# Altium project PCB_TFM.PrjPcb
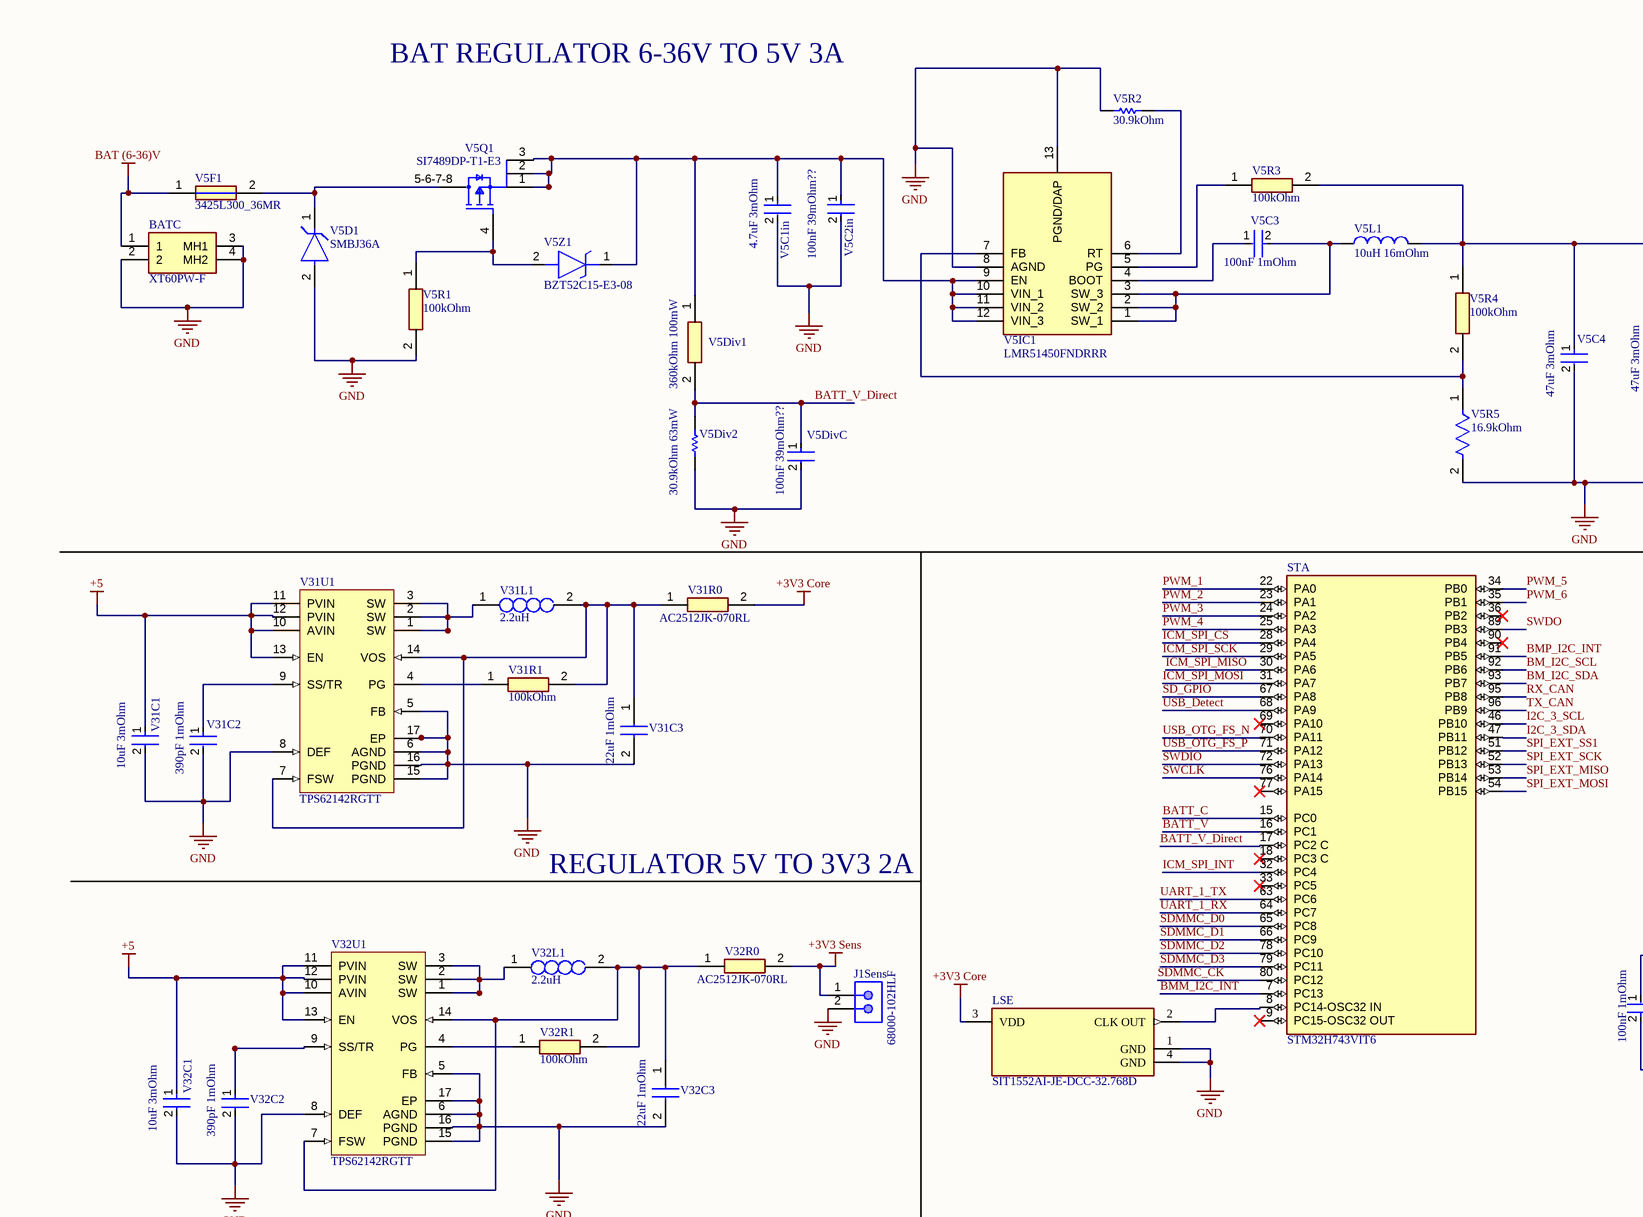
[diagram p0: Schematic_TFM.SchDoc, top left]
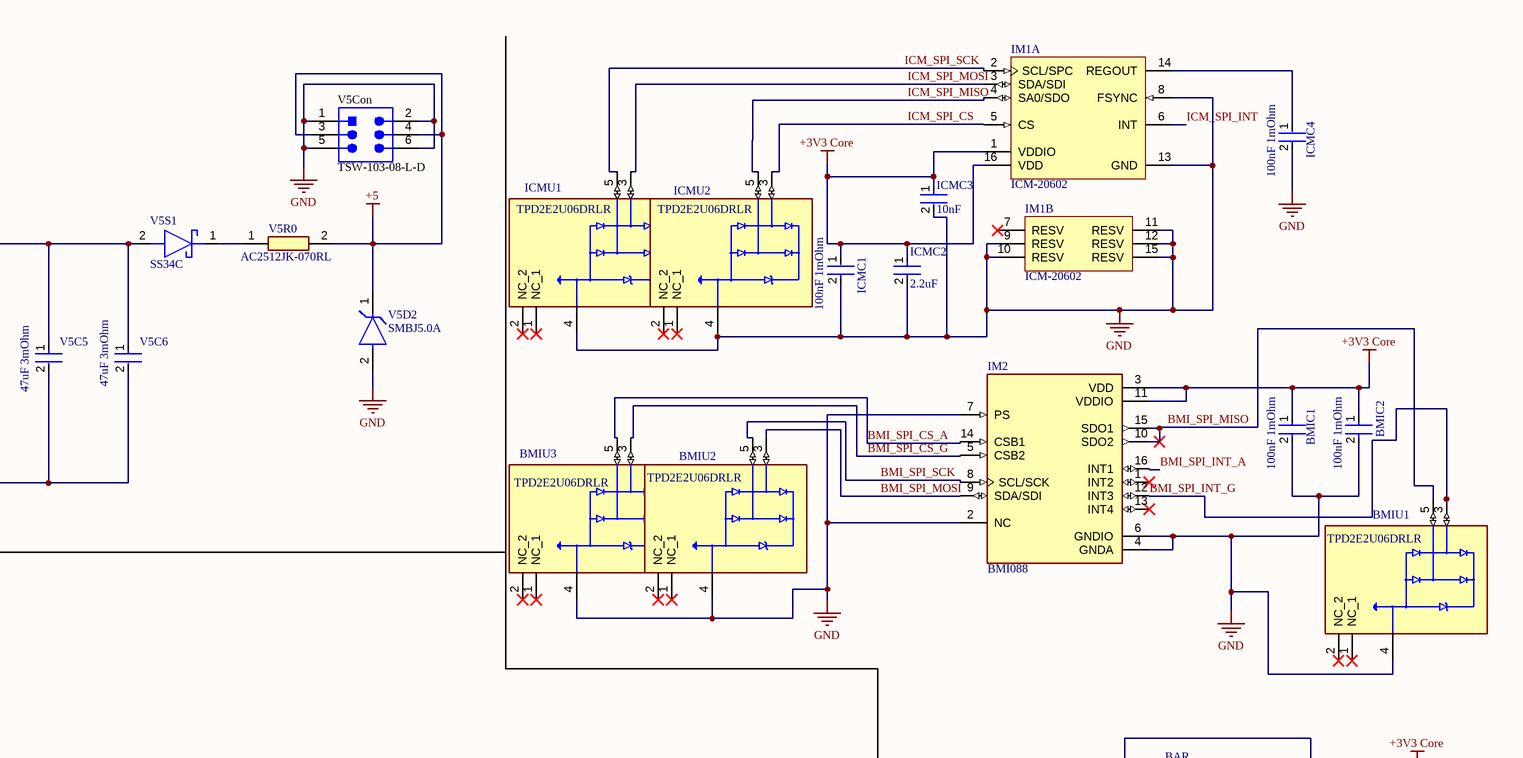
[diagram p1: Schematic_TFM.SchDoc, top right]
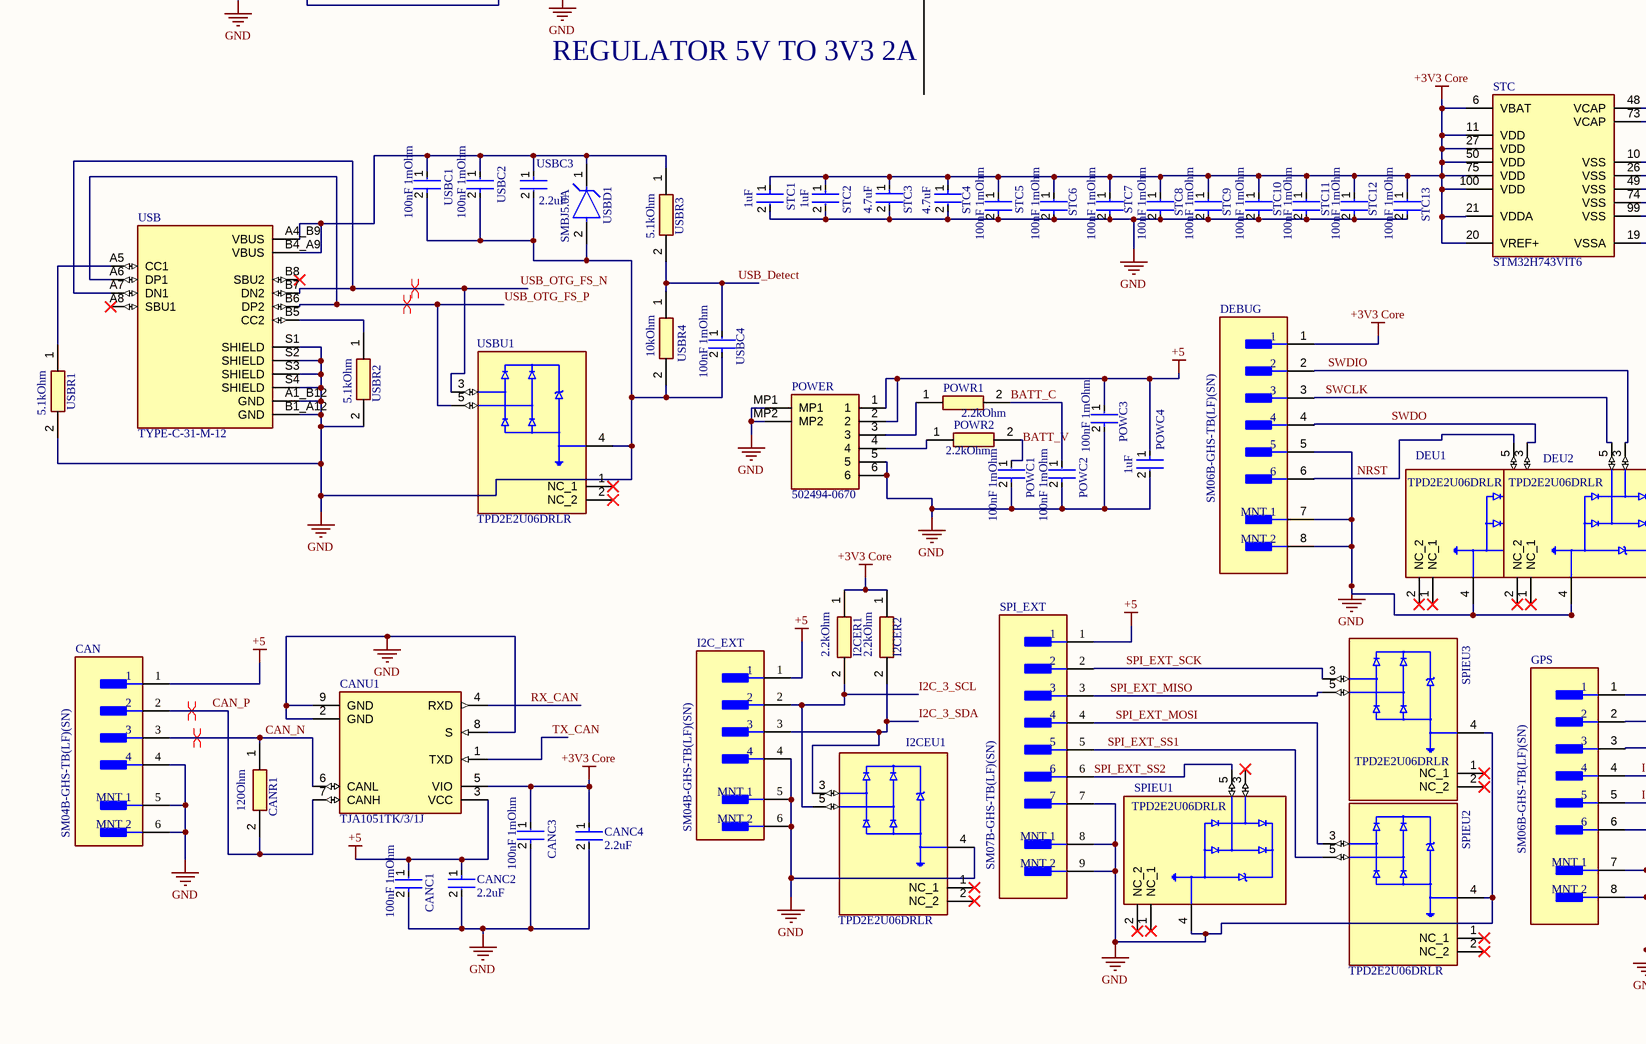
[diagram p2: Schematic_TFM.SchDoc, bottom left]
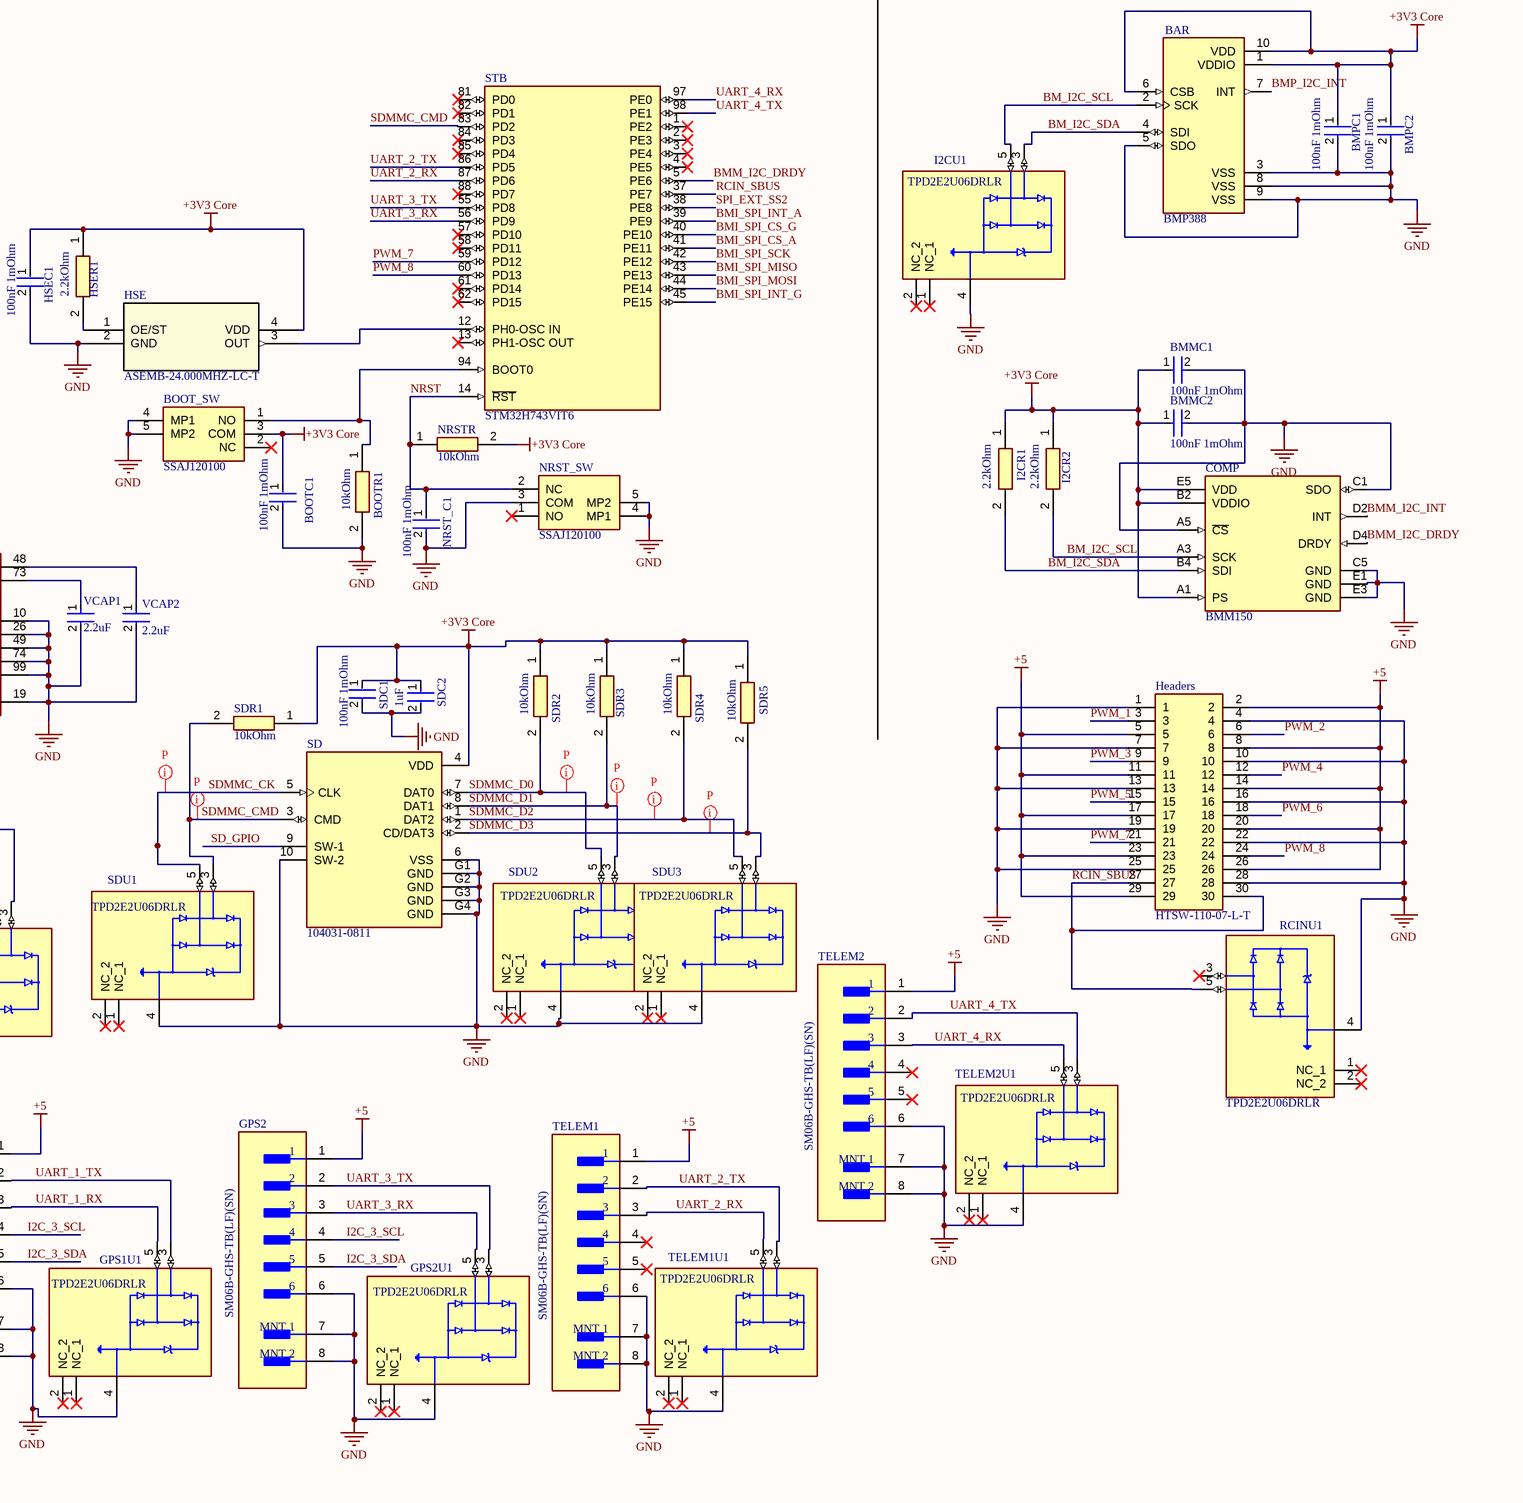
[diagram p3: Schematic_TFM.SchDoc, bottom right]
1 sheet, 145 parts. Net scope: global (net labels, ports and power ports of the same name join across sheets).
Board file: PCB_mounting.PcbDoc

## Sheet Schematic_TFM.SchDoc: DRONE PCB
size 594 x 420 mm; Date: 2025; Author: Alejnadro Boadella; CompanyName: UPC EETAC; Organization: UPC EETAC; SheetNumber: 1; SheetTotal: 1; Time: 2025

### Parts
BAR  BMP388  [PQFN50P200X200X80-10N]
BATC  XT60PW-F  [XT60PWF]
BMIC1  100nF 1mOhm  [FP-GRM15-MFG]
BMIC2  100nF 1mOhm  [FP-GRM15-MFG]
BMIU1  TPD2E2U06DRLR  [SOTFL50P160X60-5N]
BMIU2  TPD2E2U06DRLR  [SOTFL50P160X60-5N]
BMIU3  TPD2E2U06DRLR  [SOTFL50P160X60-5N]
BMMC1  100nF 1mOhm  [FP-GRM15-MFG]
BMMC2  100nF 1mOhm  [FP-GRM15-MFG]
BMPC1  100nF 1mOhm  [FP-GRM15-MFG]
BMPC2  100nF 1mOhm  [FP-GRM15-MFG]
BOOT_SW  SSAJ120100  [SSAJ120100]
BOOTC1  100nF 1mOhm  [FP-GRM15-MFG]
BOOTR1  10kOhm  [RESC1608X55N]
CAN  SM04B-GHS-TB(LF)(SN)  [FP-SM04B-GHS-TB_LF_SN-MFG]
CANC1  100nF 1mOhm  [FP-GRM15-MFG]
CANC2  2.2uF  [FP-CL50-IPC_C]
CANC3  100nF 1mOhm  [FP-GRM15-MFG]
CANC4  2.2uF  [FP-CL50-IPC_C]
CANR1  120Ohm  [RESC1608X55N]
CANU1  TJA1051TK/3/1J  [FP-SOT782-1-MFG]
COMP  BMM150  [FP-BMM150-MFG]
DEBUG  SM06B-GHS-TB(LF)(SN)  [FP-SM06B-GHS-TB_LF_SN-MFG]
DEU1  TPD2E2U06DRLR  [SOTFL50P160X60-5N]
DEU2  TPD2E2U06DRLR  [SOTFL50P160X60-5N]
GPS  SM06B-GHS-TB(LF)(SN)  [FP-SM06B-GHS-TB_LF_SN-MFG]
GPS1U1  TPD2E2U06DRLR  [SOTFL50P160X60-5N]
GPS2  SM06B-GHS-TB(LF)(SN)  [FP-SM06B-GHS-TB_LF_SN-MFG]
GPS2U1  TPD2E2U06DRLR  [SOTFL50P160X60-5N]
Headers  HTSW-110-07-L-T  [HDRV30W64P254_3X10_2540X756X838P]
HSE  ASEMB-24.000MHZ-LC-T  [SON4_SIT1602-2_SIT]
HSEC1  100nF 1mOhm  [FP-GRM15-MFG]
HSER1  2.2kOhm  [RESC1608X55N]
I2C_EXT  SM04B-GHS-TB(LF)(SN)  [FP-SM04B-GHS-TB_LF_SN-MFG]
I2CER1  2.2kOhm  [RESC1608X55N]
I2CER2  2.2kOhm  [RESC1608X55N]
I2CEU1  TPD2E2U06DRLR  [SOTFL50P160X60-5N]
I2CR1  2.2kOhm  [RESC1608X55N]
I2CR2  2.2kOhm  [RESC1608X55N]
I2CU1  TPD2E2U06DRLR  [SOTFL50P160X60-5N]
ICMC1  100nF 1mOhm  [FP-GRM15-MFG]
ICMC2  2.2uF  [FP-CL50-IPC_C]
ICMC3  10nF  [FP-CL165-IPC_C]
ICMC4  100nF 1mOhm  [FP-GRM15-MFG]
ICMU1  TPD2E2U06DRLR  [SOTFL50P160X60-5N]
ICMU2  TPD2E2U06DRLR  [SOTFL50P160X60-5N]
IM1  ICM-20602  [INSE-I62-16]  (parts A,B of 2)
IM2  BMI088  [PQFN50P450X300X100-16N]
J1Sens  68000-102HLF  [AMPH-68000-102HLF_V]
LSE  SIT1552AI-JE-DCC-32.768D  [FP-SiT1552-J-MFG]
NRST_C1  100nF 1mOhm  [FP-GRM15-MFG]
NRST_SW  SSAJ120100  [SSAJ120100]
NRSTR  10kOhm  [RESC1608X55N]
POWC1  100nF 1mOhm  [FP-GRM15-MFG]
POWC2  100nF 1mOhm  [FP-GRM15-MFG]
POWC3  100nF 1mOhm  [FP-GRM15-MFG]
POWC4  1uF  [FP-CL542-IPC_C]
POWER  502494-0670  [5024940670]
POWR1  2.2kOhm  [RESC1608X55N]
POWR2  2.2kOhm  [RESC1608X55N]
RCINU1  TPD2E2U06DRLR  [SOTFL50P160X60-5N]
SD  104031-0811  [MOLEX_104031-0811]
SDC1  100nF 1mOhm  [FP-GRM15-MFG]
SDC2  1uF  [FP-CL542-IPC_C]
SDR1  10kOhm  [RESC1608X55N]
SDR2  10kOhm  [RESC1608X55N]
SDR3  10kOhm  [RESC1608X55N]
SDR4  10kOhm  [RESC1608X55N]
SDR5  10kOhm  [RESC1608X55N]
SDU1  TPD2E2U06DRLR  [SOTFL50P160X60-5N]
SDU2  TPD2E2U06DRLR  [SOTFL50P160X60-5N]
SDU3  TPD2E2U06DRLR  [SOTFL50P160X60-5N]
SPI_EXT  SM07B-GHS-TB(LF)(SN)  [FP-SM07B-GHS-TB_LF_SN-MFG]
SPIEU1  TPD2E2U06DRLR  [SOTFL50P160X60-5N]
SPIEU2  TPD2E2U06DRLR  [SOTFL50P160X60-5N]
SPIEU3  TPD2E2U06DRLR  [SOTFL50P160X60-5N]
ST  STM32H743VIT6  [FP-LQFP100-1L-MFG]  (parts A,B,C of 3)
STC1  1uF  [FP-CL542-IPC_C]
STC2  1uF  [FP-CL542-IPC_C]
STC3  4.7uF  [FP-CL282-IPC_C]
STC4  4.7uF  [FP-CL282-IPC_C]
STC5  100nF 1mOhm  [FP-GRM15-MFG]
STC6  100nF 1mOhm  [FP-GRM15-MFG]
STC7  100nF 1mOhm  [FP-GRM15-MFG]
STC8  100nF 1mOhm  [FP-GRM15-MFG]
STC9  100nF 1mOhm  [FP-GRM15-MFG]
STC10  100nF 1mOhm  [FP-GRM15-MFG]
STC11  100nF 1mOhm  [FP-GRM15-MFG]
STC12  100nF 1mOhm  [FP-GRM15-MFG]
STC13  100nF 1mOhm  [FP-GRM15-MFG]
TELEM1  SM06B-GHS-TB(LF)(SN)  [FP-SM06B-GHS-TB_LF_SN-MFG]
TELEM1U1  TPD2E2U06DRLR  [SOTFL50P160X60-5N]
TELEM2  SM06B-GHS-TB(LF)(SN)  [FP-SM06B-GHS-TB_LF_SN-MFG]
TELEM2U1  TPD2E2U06DRLR  [SOTFL50P160X60-5N]
USB  TYPE-C-31-M-12  [HRO_TYPE-C-31-M-12]
USBC1  100nF 1mOhm  [FP-GRM15-MFG]
USBC2  100nF 1mOhm  [FP-GRM15-MFG]
USBC3  2.2uF  [FP-CL50-IPC_C]
USBC4  100nF 1mOhm  [FP-GRM15-MFG]
USBD1  SMBJ5.0A  [FP-SMBJ-MFG]
USBR1  5.1kOhm  [RESC1608X55N]
USBR2  5.1kOhm  [RESC1608X55N]
USBR3  5.1kOhm  [RESC1608X55N]
USBR4  10kOhm  [RESC1608X55N]
USBU1  TPD2E2U06DRLR  [SOTFL50P160X60-5N]
V5C1in  4.7uF 3mOhm  [FP-GRM31C-0_2-e0_3_0_8-IPC_C]
V5C2in  100nF 39mOhm??  [FP-GRM155-0_05-IPC_B]
V5C3  100nF 1mOhm  [FP-GRM15-MFG]
V5C4  47uF 3mOhm  [FP-GRM32E-0_3-0_2-IPC_C]
V5C5  47uF 3mOhm  [FP-GRM32E-0_3-0_2-IPC_C]
V5C6  47uF 3mOhm  [FP-GRM32E-0_3-0_2-IPC_C]
V5Con  TSW-103-08-L-D  [SMTC-TSW-103-08-L-D_V]
V5D1  SMBJ36A  [FP-SMBJ-MFG]
V5D2  SMBJ5.0A  [FP-SMBJ-MFG]
V5Div1  360kOhm 100mW  [RESC1608X55N]
V5Div2  30.9kOhm 63mW  [RESC1005X40X25LL05T05]
V5DivC  100nF 39mOhm??  [FP-GRM155-0_05-IPC_B]
V5F1  3425L300_36MR  [FUSC8664X140N]
V5IC1  LMR51450FNDRRR  [SON50P300X300X80-13N-D]
V5L1  10uH 16mOhm  [SUMI-CDRH127_V]
V5Q1  SI7489DP-T1-E3  [FP-S17-0173-SINGLE-MFG]
V5R0  AC2512JK-070RL  [RESC6431X65N]
V5R1  100kOhm  [RESC2013X65N]
V5R2  30.9kOhm  [RESC1005X40X25LL05T05]
V5R3  100kOhm  [RESC2013X65N]
V5R4  100kOhm  [RESC2013X65N]
V5R5  16.9kOhm  [FP-CRCW0402-e3-MFG]
V5S1  SS34C  [DIOM7959X262N]
V5Z1  BZT52C15-E3-08  [SOD3716X135N]
V31C1  10uF 3mOhm  [FP-C0805C-DG-MFG]
V31C2  390pF 1mOhm  [FP-CC0603-DA-MFG]
V31C3  22uF 1mOhm  [CAPC1608X90N]
V31L1  2.2uH  [INDPM4042X200N]
V31R0  AC2512JK-070RL  [RESC6431X65N]
V31R1  100kOhm  [RESC2013X65N]
V31U1  TPS62142RGTT  [RGT0016C_V]
V32C1  10uF 3mOhm  [FP-C0805C-DG-MFG]
V32C2  390pF 1mOhm  [FP-CC0603-DA-MFG]
V32C3  22uF 1mOhm  [CAPC1608X90N]
V32L1  2.2uH  [INDPM4042X200N]
V32R0  AC2512JK-070RL  [RESC6431X65N]
V32R1  100kOhm  [RESC2013X65N]
V32U1  TPS62142RGTT  [RGT0016C_V]
VCAP1  2.2uF  [FP-CL50-IPC_C]
VCAP2  2.2uF  [FP-CL50-IPC_C]

### Nets
+3V3 Core: BAR.1(VDDIO) BAR.6(CSB) BAR.10(VDD) BMIC1.1 BMIC2.1 BMMC1.1 BMMC2.1 BMPC1.1 BMPC2.1 BOOT_SW.3(COM) BOOTC1.1 CANC3.1 CANC4.1 CANU1.5(VIO) COMP.A1(PS) COMP.B2(VDDIO) COMP.E5(VDD) DEBUG.1 HSE.4(VDD) HSEC1.1 HSER1.1 I2CER1.1 I2CER2.1 I2CR1.1 I2CR2.1 ICMC1.1 ICMC2.1 ICMC3.1 IM1.1(VDDIO) IM1.16(VDD) IM2.3(VDD) IM2.11(VDDIO) LSE.3(VDD) NRSTR.2 SD.4(VDD) SDC1.1 SDC2.1 SDR1.1 SDR2.1 SDR3.1 SDR4.1 SDR5.1 ST.6(VBAT) ST.11(VDD) ST.20(VREF+) ST.21(VDDA) ST.27(VDD) ST.50(VDD) ST.75(VDD) ST.100(VDD) STC1.1 STC2.1 STC3.1 STC4.1 STC5.1 STC6.1 STC7.1 STC8.1 STC9.1 STC10.1 STC11.1 STC12.1 STC13.1 V31R0.2
+3V3 Sens: J1Sens.1 V32R0.2
+5: CAN.1 CANC1.1 CANC2.1 CANU1.3(VCC) GPS.1 GPS2.1 Headers.2 Headers.5 Headers.8 Headers.11 Headers.14 Headers.17 Headers.20 Headers.23 Headers.26 Headers.29 I2C_EXT.1 POWC3.1 POWC4.1 POWER.1 POWER.2 SPI_EXT.1 TELEM1.1 TELEM2.1 V5Con.3 V5Con.4 V5D2.1(C) V5R0.2 V31C1.1 V31U1.10(AVIN) V31U1.11(PVIN) V31U1.12(PVIN) V31U1.13(EN) V32C1.1 V32U1.10(AVIN) V32U1.11(PVIN) V32U1.12(PVIN) V32U1.13(EN)
BAT (6-36)V: BATC.1 V5F1.1
GND: BAR.3(VSS) BAR.5(SDO) BAR.8(VSS) BAR.9(VSS) BATC.2 BATC.3(MH1) BATC.4(MH2) BMIC1.2 BMIC2.2 BMIU1.4(GND) BMIU2.4(GND) BMIU3.4(GND) BMMC1.2 BMMC2.2 BMPC1.2 BMPC2.2 BOOT_SW.4(MP1) BOOT_SW.5(MP2) BOOTC1.2 BOOTR1.2 CAN.4 CAN.5(MNT_1) CAN.6(MNT_2) CANC1.2 CANC2.2 CANC3.2 CANC4.2 CANU1.2(GND) CANU1.8(S) CANU1.9(GND) COMP.A5(~{CS}) COMP.C1(SDO) COMP.C5(GND) COMP.E1(GND) COMP.E3(GND) DEBUG.5 DEBUG.7(MNT_1) DEBUG.8(MNT_2) DEU1.4(GND) DEU2.4(GND) GPS.6 GPS.7(MNT_1) GPS.8(MNT_2) GPS1U1.4(GND) GPS2.6 GPS2.7(MNT_1) GPS2.8(MNT_2) GPS2U1.4(GND) Headers.1 Headers.4 Headers.7 Headers.10 Headers.13 Headers.16 Headers.19 Headers.22 Headers.25 Headers.28 HSE.2(GND) HSEC1.2 I2C_EXT.4 I2C_EXT.5(MNT_1) I2C_EXT.6(MNT_2) I2CEU1.4(GND) I2CU1.4(GND) ICMC1.2 ICMC2.2 ICMC3.2 ICMC4.2 ICMU1.4(GND) ICMU2.4(GND) IM1.8(FSYNC) IM1.9(RESV) IM1.10(RESV) IM1.11(RESV) IM1.12(RESV) IM1.13(GND) IM1.15(RESV) IM2.2(NC) IM2.4(GNDA) IM2.6(GNDIO) IM2.7(PS) J1Sens.2 LSE.1(GND) LSE.4(GND) NRST_C1.2 NRST_SW.3(COM) NRST_SW.4(MP1) NRST_SW.5(MP2) POWC1.2 POWC2.2 POWC3.2 POWC4.2 POWER.5 POWER.6 POWER.MP1 POWER.MP2 RCINU1.4(GND) SD.6(VSS) SD.10(SW-2) SD.G1(GND) SD.G2(GND) SD.G3(GND) SD.G4(GND) SDC1.2 SDC2.2 SDU1.4(GND) SDU2.4(GND) SDU3.4(GND) SPI_EXT.7 SPI_EXT.8(MNT_1) SPI_EXT.9(MNT_2) SPIEU1.4(GND) SPIEU2.4(GND) SPIEU3.4(GND) ST.10(VSS) ST.19(VSSA) ST.26(VSS) ST.49(VSS) ST.74(VSS) ST.99(VSS) STC1.2 STC2.2 STC3.2 STC4.2 STC5.2 STC6.2 STC7.2 STC8.2 STC9.2 STC10.2 STC11.2 STC12.2 STC13.2 TELEM1.6 TELEM1.7(MNT_1) TELEM1.8(MNT_2) TELEM1U1.4(GND) TELEM2.6 TELEM2.7(MNT_1) TELEM2.8(MNT_2) TELEM2U1.4(GND) USB.A1_B12(GND) USB.B1_A12(GND) USB.S1(SHIELD) USB.S2(SHIELD) USB.S3(SHIELD) USB.S4(SHIELD) USBC1.2 USBC2.2 USBC3.2 USBC4.2 USBD1.2(A) USBR1.2 USBR2.2 USBR4.2 USBU1.4(GND) V5C1in.2 V5C2in.2 V5C4.2 V5C5.2 V5C6.2 V5Con.1 V5Con.2 V5Con.5 V5Con.6 V5D1.2(A) V5D2.2(A) V5Div2.2 V5DivC.2 V5IC1.8(AGND) V5IC1.13(PGND/DAP) V5R1.2 V5R2.2 V5R5.2 V31C1.2 V31C2.2 V31C3.2 V31U1.5(FB) V31U1.6(AGND) V31U1.8(DEF) V31U1.15(PGND) V31U1.16(PGND) V31U1.17(EP) V32C1.2 V32C2.2 V32C3.2 V32U1.5(FB) V32U1.6(AGND) V32U1.8(DEF) V32U1.15(PGND) V32U1.16(PGND) V32U1.17(EP) VCAP1.2 VCAP2.2
BATT_C: POWC2.1 POWR1.2 ST.15(PC0)
BATT_V: POWC1.1 POWR2.2 ST.16(PC1)
BATT_V_Direct: ST.17(PC2_C) V5Div1.2 V5Div2.1 V5DivC.1
BM_I2C_SCL: BAR.2(SCK) COMP.A3(SCK) I2CR2.2 I2CU1.5(IO2) ST.92(PB6)
BM_I2C_SDA: BAR.4(SDI) COMP.B4(SDI) I2CR1.2 I2CU1.3(IO1) ST.93(PB7)
BMI_SPI_CS_A: BMIU3.5(IO2) IM2.14(CSB1) ST.41(PE11)
BMI_SPI_CS_G: BMIU3.3(IO1) IM2.5(CSB2) ST.40(PE10)
BMI_SPI_INT_A: IM2.16(INT1) ST.39(PE9)
BMI_SPI_INT_G: BMIU1.3(IO1) IM2.12(INT3) ST.45(PE15)
BMI_SPI_MISO: BMIU1.5(IO2) IM2.10(SDO2) IM2.15(SDO1) ST.43(PE13)
BMI_SPI_MOSI: BMIU2.3(IO1) IM2.9(SDA/SDI) ST.44(PE14)
BMI_SPI_SCK: BMIU2.5(IO2) IM2.8(SCL/SCK) ST.42(PE12)
BMM_I2C_DRDY: COMP.D4(DRDY) ST.5(PE6)
BMM_I2C_INT: COMP.D2(INT) ST.7(PC13)
BMP_I2C_INT: BAR.7(INT) ST.91(PB5)
CAN_N: CAN.3 CANR1.1 CANU1.6(CANL)
CAN_P: CAN.2 CANR1.2 CANU1.7(CANH)
I2C_3_SCL: GPS.4 GPS2.4 I2C_EXT.2 I2CER1.2 I2CEU1.5(IO2) ST.46(PB10)
I2C_3_SDA: GPS.5 GPS2.5 I2C_EXT.3 I2CER2.2 I2CEU1.3(IO1) ST.47(PB11)
ICM_SPI_CS: ICMU2.3(IO1) IM1.5(CS) ST.28(PA4)
ICM_SPI_INT: IM1.6(INT) ST.32(PC4)
ICM_SPI_MISO: ICMU2.5(IO2) IM1.4(SA0/SDO) ST.30(PA6)
ICM_SPI_MOSI: ICMU1.3(IO1) IM1.3(SDA/SDI) ST.31(PA7)
ICM_SPI_SCK: ICMU1.5(IO2) IM1.2(SCL/SPC) ST.29(PA5)
NRST: DEBUG.6 DEU1.5(IO2) NRST_C1.1 NRST_SW.2(NC) NRSTR.1 ST.14(~{RST})
PWM_1: Headers.3 ST.22(PA0)
PWM_2: Headers.6 ST.23(PA1)
PWM_3: Headers.9 ST.24(PA2)
PWM_4: Headers.12 ST.25(PA3)
PWM_5: Headers.15 ST.34(PB0)
PWM_6: Headers.18 ST.35(PB1)
PWM_7: Headers.21 ST.59(PD12)
PWM_8: Headers.24 ST.60(PD13)
RCIN_SBUS: Headers.27 Headers.30 RCINU1.5(IO2) ST.37(PE7)
RX_CAN: CANU1.4(RXD) ST.95(PB8)
SD_GPIO: SD.9(SW-1) ST.67(PA8)
SDMMC_CK: SD.5(CLK) SDU1.5(IO2) ST.80(PC12)
SDMMC_CMD: SD.3(CMD) SDR1.2 SDU1.3(IO1) ST.83(PD2)
SDMMC_D0: SD.7(DAT0) SDR2.2 SDU2.5(IO2) ST.65(PC8)
SDMMC_D1: SD.8(DAT1) SDR3.2 SDU2.3(IO1) ST.66(PC9)
SDMMC_D2: SD.1(DAT2) SDR4.2 SDU3.5(IO2) ST.78(PC10)
SDMMC_D3: SD.2(CD/DAT3) SDR5.2 SDU3.3(IO1) ST.79(PC11)
SPI_EXT_MISO: SPI_EXT.3 SPIEU3.5(IO2) ST.53(PB14)
SPI_EXT_MOSI: SPI_EXT.4 SPIEU2.3(IO1) ST.54(PB15)
SPI_EXT_SCK: SPI_EXT.2 SPIEU3.3(IO1) ST.52(PB13)
SPI_EXT_SS1: SPI_EXT.5 SPIEU2.5(IO2) ST.51(PB12)
SPI_EXT_SS2: SPI_EXT.6 SPIEU1.5(IO2) ST.38(PE8)
SWCLK: DEBUG.3 DEU2.5(IO2) ST.76(PA14)
SWDIO: DEBUG.2 DEU2.3(IO1) ST.72(PA13)
SWDO: DEBUG.4 DEU1.3(IO1) ST.89(PB3)
TX_CAN: CANU1.1(TXD) ST.96(PB9)
UART_1_RX: GPS.3 GPS1U1.5(IO2) ST.64(PC7)
UART_1_TX: GPS.2 GPS1U1.3(IO1) ST.63(PC6)
UART_2_RX: ST.87(PD6) TELEM1.3 TELEM1U1.5(IO2)
UART_2_TX: ST.86(PD5) TELEM1.2 TELEM1U1.3(IO1)
UART_3_RX: GPS2.3 GPS2U1.5(IO2) ST.56(PD9)
UART_3_TX: GPS2.2 GPS2U1.3(IO1) ST.55(PD8)
UART_4_RX: ST.97(PE0) TELEM2.3 TELEM2U1.5(IO2)
UART_4_TX: ST.98(PE1) TELEM2.2 TELEM2U1.3(IO1)
USB_Detect: ST.68(PA9) USBC4.1 USBR3.2 USBR4.1
USB_OTG_FS_N: ST.70(PA11) USB.A7(DN1) USB.B7(DN2) USBU1.3(IO1)
USB_OTG_FS_P: ST.71(PA12) USB.A6(DP1) USB.B6(DP2) USBU1.5(IO2)
NetBOOT_SW_1: BOOT_SW.1(NO) BOOTR1.1 ST.94(BOOT0)
NetHSE_1: HSE.1(OE/ST) HSER1.2
NetHSE_3: HSE.3(OUT) ST.12(PH0-OSC_IN)
NetICMC4_1: ICMC4.1 IM1.14(REGOUT)
NetLSE_2: LSE.2(CLK_OUT) ST.8(PC14-OSC32_IN)
NetPOWER_3: POWER.3 POWR1.1
NetPOWER_4: POWER.4 POWR2.1
NetST_48: ST.48(VCAP) VCAP2.1
NetST_73: ST.73(VCAP) VCAP1.1
NetUSB_A4_B9: USB.A4_B9(VBUS) USB.B4_A9(VBUS) USBC1.1 USBC2.1 USBC3.1 USBD1.1(C) USBR3.1
NetUSB_A5: USB.A5(CC1) USBR1.1
NetUSB_B5: USB.B5(CC2) USBR2.1
NetV5C1in_1: V5C1in.1 V5C2in.1 V5Div1.1 V5IC1.9(EN) V5IC1.10(VIN_1) V5IC1.11(VIN_2) V5IC1.12(VIN_3) V5Q1.1(S) V5Q1.2(S) V5Q1.3(S) V5Z1.1(K)
NetV5C3_1: V5C3.1 V5IC1.4(BOOT)
NetV5C3_2: V5C3.2 V5IC1.1(SW_1) V5IC1.2(SW_2) V5IC1.3(SW_3) V5L1.1
NetV5C4_1: V5C4.1 V5C5.1 V5C6.1 V5L1.2 V5R3.2 V5R4.1 V5S1.2(A)
NetV5D1_1: V5D1.1(C) V5F1.2 V5Q1.5-6-7-8(D)
NetV5IC1_5: V5IC1.5(PG) V5R3.1
NetV5IC1_6: V5IC1.6(RT) V5R2.1
NetV5IC1_7: V5IC1.7(FB) V5R4.2 V5R5.1
NetV5Q1_4: V5Q1.4(G) V5R1.1 V5Z1.2(A)
NetV5R0_1: V5R0.1 V5S1.1(K)
NetV31C2_1: V31C2.1 V31U1.9(SS/TR)
NetV31C3_1: V31C3.1 V31L1.2 V31R0.1 V31R1.2 V31U1.7(FSW) V31U1.14(VOS)
NetV31L1_1: V31L1.1 V31U1.1(SW) V31U1.2(SW) V31U1.3(SW)
NetV31R1_1: V31R1.1 V31U1.4(PG)
NetV32C2_1: V32C2.1 V32U1.9(SS/TR)
NetV32C3_1: V32C3.1 V32L1.2 V32R0.1 V32R1.2 V32U1.7(FSW) V32U1.14(VOS)
NetV32L1_1: V32L1.1 V32U1.1(SW) V32U1.2(SW) V32U1.3(SW)
NetV32R1_1: V32R1.1 V32U1.4(PG)

Not connected (* = marked no-connect by the designer): BMIU1 1(NC_1)* 2(NC_2)*; BMIU2 1(NC_1)* 2(NC_2)*; BMIU3 1(NC_1)* 2(NC_2)*; BOOT_SW 2(NC)*; DEU1 1(NC_1)* 2(NC_2)*; DEU2 1(NC_1)* 2(NC_2)*; GPS1U1 1(NC_1)* 2(NC_2)*; GPS2U1 1(NC_1)* 2(NC_2)*; I2CEU1 1(NC_1)* 2(NC_2)*; I2CU1 1(NC_1)* 2(NC_2)*; ICMU1 1(NC_1)* 2(NC_2)*; ICMU2 1(NC_1)* 2(NC_2)*; IM1 7(RESV)*; IM2 1(INT2)* 13(INT4)*; NRST_SW 1(NO)*; RCINU1 1(NC_1)* 2(NC_2)* 3(IO1)*; SDU1 1(NC_1)* 2(NC_2)*; SDU2 1(NC_1)* 2(NC_2)*; SDU3 1(NC_1)* 2(NC_2)*; SPIEU1 1(NC_1)* 2(NC_2)* 3(IO1)*; SPIEU2 1(NC_1)* 2(NC_2)*; SPIEU3 1(NC_1)* 2(NC_2)*; ST 1(PE2)* 2(PE3)* 3(PE4)* 4(PE5)* 9(PC15-OSC32_OUT)* 13(PH1-OSC_OUT)* 18(PC3_C)* 33(PC5)* 36(PB2)* 57(PD10)* 58(PD11)* 61(PD14)* 62(PD15)* 69(PA10)* 77(PA15)* 81(PD0)* 82(PD1)* 84(PD3)* 85(PD4)* 88(PD7)* 90(PB4)*; TELEM1 4* 5*; TELEM1U1 1(NC_1)* 2(NC_2)*; TELEM2 4* 5*; TELEM2U1 1(NC_1)* 2(NC_2)*; USB A8(SBU1)* B8(SBU2)*; USBU1 1(NC_1)* 2(NC_2)*

### Layout directives
rule Matched Net Lengths [Tolerance = 1.5mm]; net class SDMMC: SDMMC_CK, SDMMC_CMD, SDMMC_D0, SDMMC_D1, SDMMC_D2, SDMMC_D3
differential pair; net class DIFF90: USB_OTG_FS_N, USB_OTG_FS_P
differential pair; net class DIFF120: CAN_N, CAN_P

### Notes on the sheet
- BAT REGULATOR 6-36V TO 5V 3A
- REGULATOR 5V TO 3V3 2A
- DWG NO:
- REV:
- THIS DOCUMENT AND THE DATA DISCLOSED HEREIN OR
- HEREWITH IS THE PROPERTY OF ALTIUM LIMITED AND MAY
- BE FREELY DISTRIBUTED IN WHOLE. NO RIGHTS ARE
- RESERVED OR EXPRESS OR IMPLIED WARANTEE GIVEN.
- REVISION
- DESCRIPTION
- DATE
- APPROVED
- ENG:
- APPROVALS
- PROJECT
- DSN:
- CHK:
- REFERENCE DOCUMENTS
- PROJECT REVISION:
- TITLE
- DOCUMENT REVISION:
- DESIGN ITEM:
- BOM:
- FAB DWG:
- PCB DWG:
- ASSY DWG:
- SCALE:
- A2
- SIZE
- CAGE CODE
- FILE NAME
- DWG NO.
- SHEET
- OF
- REV

### Library data of the parts
BAR = BMP388: P-Sensor SPI I2C 1, 25 Bar SMD; Package: None; Price: None; Value: *; MP: BMP388; Availability: Unavailable
BATC = XT60PW-F: Connector; Manufacturer_Name: Amass; Datasheet Link: https://www.tme.eu/Document/1191bc2fa3aee3c446e5a895fd8f7983/XT60PW-F.pdf; Height: 8.4mm; Manufacturer_Part_Number: XT60PW-F
BMIC1 BMIC2 BMMC1 BMMC2 BMPC1 BMPC2 BOOTC1 CANC1 CANC3 HSEC1 ICMC1 ICMC4 NRST_C1 POWC1-POWC3 SDC1 STC5-STC13 USBC1 USBC2 USBC4 V5C3 = CMP-2100-03641-2: CAP CER 0.1UF 16V X7R 0402; Manufacturer Part Number: GRM155R71C104KA88D; Manufacturer: Murata; Standoff Height: 0mm; Tolerance: 10%; Voltage Rating: 16Vdc; Capacitance: 0.10μF; Value: 0.10μF; RoHS: TRUE; Temperature Characteristic: X7R; Octopart: https://octopart.com/grm155r71c104ka88d-murata-196880; Digikey Description: CAP CER 0.1UF 16V X7R 0402; Device Class L3: Ceramic Capacitors; Height: 0.55mm; ComponentLink2Description: Datasheet; Temperature Range Low: -55°C; Ipc Land Pattern Name: CAPC10050X219; ComponentLink2URL: https://search.murata.co.jp/Ceramy/image/img/A01X/G101/ENG/GRM155R71H471KA01-01A.pdf; Device Class L1: Passive Components; Lead Free: yes; Category: Cap; Package: GRM15; Temperature: -55°C to +125°C; Device Class L2: Capacitors; Material: Ceramic; Temperature Range High: +125°C; Mouser Description: 0402 0.1 uF 16V ±10 % Tolerance X7R SMT Multilayer Ceramic Capacitor
BMIU1-BMIU3 DEU1 DEU2 GPS1U1 GPS2U1 I2CEU1 I2CU1 ICMU1 ICMU2 RCINU1 SDU1-SDU3 SPIEU1-SPIEU3 TELEM1U1 TELEM2U1 USBU1 = TPD2E2U06DRLR: <a href="https://snapeda.com/parts/TPD2E2U06DRLR/Texas%20Instruments/view-part/?ref=eda">Check prices</a>; Price: None; Package: None; Availability: Unavailable; MP: TPD2E2U06DRLR; Value: *
BOOT_SW NRST_SW = SSAJ120100: Switch; Manufacturer_Name: ALPS Electric; Datasheet Link: https://tech.alpsalpine.com/e/products/detail/SSAJ120100/#ancFig2; Height: 0.9mm; Manufacturer_Part_Number: SSAJ120100; Mouser Part Number: 688-SSAJ120100; Mouser Price/Stock: https://www.mouser.co.uk/ProductDetail/Alps-Alpine/SSAJ120100?qs=35GPJvxY%252Bl5mRNwFoBrl2g%3D%3D
BOOTR1 NRSTR SDR1-SDR5 USBR4 = 0603WAF1002T5E: Resistor; Manufacturer_Name: ROYALOHM; Datasheet Link: https://th.mouser.com/datasheet/2/1365/1-3044649.pdf; Height: 0.55mm; Manufacturer_Part_Number: 0603WAF1002T5E; Mouser Part Number: 303-0603WAF1002T5E; Mouser Price/Stock: https://www.mouser.co.uk/ProductDetail/Royalohm/0603WAF1002T5E?qs=e8oIoAS2J1TC2D0IjbSyGA%3D%3D
CAN I2C_EXT = CMP-17439-000411-1: CONN HEADER SMD R/A 4POS 1.25MM; Voltage Rating: 50V; Number of Contacts: 4; Current Rating: 1A; Termination: Solder; Mount: Surface Mount; REACH SVHC: No SVHC; Packaging: Cut Tape; Contact Material: Bronze; Series: GH; Orientation: Right Angle; Lead Free: Lead Free; Housing Material: Nylon; Contact Plating: Tin; Housing Color: Natural; Number of Rows: 1; Pitch: 1.25mm; Number of Positions: 4
CANC2 CANC4 ICMC2 USBC3 VCAP1 VCAP2 = CMP-13271-001039-1: Cap Ceramic 2.2uF 6.3V X5R ±20% SMD 0402 +85°C Paper T/R; Length: 1mm; Capacitance: 2.2uF; Height: 0.5mm; Tolerance: 20%; Case/Package: 0402; Width: 0.02inch; Mount: Surface Mount; Case Code (Imperial): 0402; Case Code (Metric): 1005; Depth: 0.5mm; Lead Free: Lead Free; Package Quantity: 10000; Min Operating Temperature: -55°C; Max Operating Temperature: 85°C; Dielectric: X5R; Voltage Rating: 6.3V; Thickness: 0.022inch; Radiation Hardening: No; Packaging: Tape and Reel
CANR1 = 0603WAF1200T5E: Resistor; Manufacturer_Name: ROYALOHM; Datasheet Link: https://www.mouser.ch/datasheet/2/1365/1-3044649.pdf; Height: 0.55mm; Manufacturer_Part_Number: 0603WAF1200T5E; Mouser Part Number: 303-0603WAF1200T5E; Mouser Price/Stock: https://www.mouser.co.uk/ProductDetail/Royalohm/0603WAF1200T5E?qs=e8oIoAS2J1TIzlbaXq7mcg%3D%3D
CANU1 = CMP-10098-000001-1: IC TRANSCEIVER HALF 1/1 8HVSON; Manufacturer: NXP; Standoff Height: 0mm; Max Junction Temp: +150°C; Min Supply Voltage: 2.8V; Max Supply Voltage: 5.5V; Automotive Grade: Grade 0; Nominal Supply Current: 5-80mA; Interface: CAN; Temperature Range High: +150°C; Footprint Url: https://www.nxp.com/docs/en/package-information/SOT782-1.pdf; Ipc Land Pattern Name: DFN300X300X85-8; RoHS: TRUE; Mouser Description: TJA1051 Single 5 V 1 MBd Surface Mount High Speed CAN Transceiver - HVSON-8; Height: 1mm; Device Class L1: Integrated Circuits (ICs); Temperature: -40°C to +150°C; Temperature Range Low: -40°C; Manufacturer Part Number: TJA1051TK/3/1J; Category: IC; Octopart: https://octopart.com/tja1051tk%2F3%2F1j-nxp+semiconductors-47257182; Lead Free: Yes; ComponentLink2Description: Datasheet; Automotive: Yes; ComponentLink2URL: https://www.nxp.com/docs/en/data-sheet/TJA1051.pdf; Package: SOT782-1; Device Class L3: unset; Device Class L2: Interface ICs; Digikey Description: IC TRANSCEIVER HALF 1/1 8HVSON
COMP = CMP-191063-000001-2: SENSOR FLIPCORE/HALL SPI 12WLCSP; Max Supply Current: 20mA; Operating Supply Voltage: 3.6V; Bandwidth: 10Hz; Axis: X, Y, Z; Resolution: 13b; Case/Package: SMD/SMT; Max Operating Temperature: 85°C; Min Operating Temperature: -40°C; Output Type: SPI; Packaging: Tape and Reel; Package Quantity: 10000
DEBUG GPS GPS2 TELEM1 TELEM2 = CMP-17439-000061-1: CONN HEADER SMD R/A 6POS 1.25MM; Number of Contacts: 6; Voltage Rating: 50V; Current Rating: 1A; Connector Type: Outer Shroud Contact; Contact Resistance: 50mR; Orientation: Right Angle; Max Operating Temperature: 85°C; Mount: Surface Mount; Packaging: Tape and Reel; Contact Plating: Tin; Depth: 4.05mm; Max Voltage Rating (AC): 50V; Lead Free: Lead Free; Pitch: 1.25mm; Number of Positions: 6; Max Current Rating: 1A; Termination: Solder; Min Operating Temperature: -25°C; Housing Color: Beige; Fastening Type: Ramp; Length: 10.75mm; Color: Natural; Contact Material: Bronze; Housing Material: Polyamide; Number of Rows: 1
Headers = HTSW-110-07-L-T: Connector; Manufacturer_Name: SAMTEC; Datasheet Link: http://suddendocs.samtec.com/catalog_english/htsw_th.pdf; Height: 8.38mm; Manufacturer_Part_Number: HTSW-110-07-L-T; Mouser Part Number: 200-HTSW11007LT; Mouser Price/Stock: https://www.mouser.co.uk/ProductDetail/Samtec/HTSW-110-07-L-T?qs=Cqqh%252BS766wkQxTMjUucNrQ%3D%3D; Arrow Part Number: HTSW-110-07-L-T; Arrow Price/Stock: https://www.arrow.com/en/products/htsw-110-07-l-t/samtec?region=nac
HSE = SIT1602AI-22-33E-26.000000D: No Description Available; Manufacturer_Name: SiTime; Copyright: Copyright (C) 2025 Ultra Librarian. All rights reserved.; Manufacturer_Part_Number: SIT1602AI-22-33E-26.000000D; RefDes: RefDes; Type: Type
HSER1 I2CER1 I2CER2 I2CR1 I2CR2 POWR1 POWR2 = 0603WAF2201T5E: Resistor; Manufacturer_Name: ROYALOHM; Datasheet Link: https://www.mouser.com/datasheet/2/1365/1-3044649.pdf; Height: 0.55mm; Manufacturer_Part_Number: 0603WAF2201T5E; Mouser Part Number: 303-0603WAF2201T5E; Mouser Price/Stock: https://www.mouser.co.uk/ProductDetail/Royalohm/0603WAF2201T5E?qs=e8oIoAS2J1Rz1NSs0bsVww%3D%3D
ICMC3 = CMP-13271-000387-1: Cap Ceramic 10nF 50V X7R ±10% SMD 0402 +125°C Paper T/R; Depth: 0.5mm; Length: 1mm; Lead Free: Lead Free; Case Code (Metric): 1005; Width: 0.02inch; Min Operating Temperature: -55°C; Thickness: 0.022inch; Package Quantity: 1; Mount: Surface Mount; Height: 0.5mm; Voltage: 50V; Material: Ceramic; Tolerance: 10%; Case Code (Imperial): 0402; Radiation Hardening: No; Case/Package: 0402; Max Operating Temperature: 125°C; Voltage Rating (DC): 50V; Contact Plating: Tin; Packaging: Tape and Reel; Voltage Rating: 50V; Capacitance: 10nF; Dielectric: X7R
IM1 = CMP-2000-07589-1: High Performance 6-Axis MEMS MotionTracking(TM) Device, 1.71 to 3.45 V, -40 to 85 degC, 16-Pin LGA, RoHS; Manufacturer: InvenSense; Sensor Type: Temperature; Output Type: I2C; RoHSCompliant: True; Datasheet Version: Rev. 1.0, 10/2016; Datasheet URL: http://www.invensense.com/wp-content/uploads/2016/10/DS-000176-ICM-20602-v1.0.pdf; Min Operating Temperature: -40degC; Mounting Technology: SurfaceMount; Max Operating Temperature: 85degC; Manufacturer URL: http://www.invensense.com/; Package Reference: I62-16; Package Description: 16-Pin Land Grid Array, Body 3 x 3 mm, Pitch 0.5 mm
IM2 = BMI088: High-performance 6-axis inertial sensor (accelerometer + gyroscope) <a href="https://pricing.snapeda.com/parts/BMI088/Bosch%20Sensortec/view-part?ref=eda">Check prices</a>; Package: None; MP: BMI088; Value: *; Availability: Unavailable; Price: None
J1Sens = CMP-2000-05666-1: Male Header, Pitch 2.54 mm, 1 x 2 Position, Height 8.38 mm, Tail Length 2.41 mm, RoHS, Bulk; Number of Positions: 2; Insulation Resistance: 5000MOhms; Voltage Rating: 1.5kV; Mounting Angle: Vertical; Pitch: 2.54mm; Brand: FCI; Current Rating: 3A; Mating Post Length: 5.84mm; Operating Temperature Range: -65Cto+125C; Product Category: Headers&WireHousings; Datasheet URL: https://datasheet.ciiva.com/5149/68000-274228-5149165.pdf; Number of Positions / Contacts: 2; Contact Gender: Pin(Male); Packaging: Bulk; Mounting Technology: ThroughHole; Product Type: Headers; Housing Material: Thermoplastic; Contact Material: PhosphorBronze; Contact Plating: Gold/GTX; Package Description: Male Header, Pitch 2.54 mm, 1 x 2 Position, Height 8.38 mm, Tail Length 2.41 mm; Package Reference: 68000-102HLF; Type: Unshrouded; Factory Pack Quantity: 100; Termination Style: ThroughHole; RoHS: Details; Series: 68000; Mounting Style: ThroughHole; Flammability Rating: UL94V-0; Number of Rows: 1; Manufacturer: FCI; Termination Post Length: 2.41mm; Manufacturer URL: http://www.amphenol.com/; Datasheet Version: Rev. F, 04/2006
LSE = CMP-25159-264721-1: MEMS OSC TCXO 32.7680KHZ LVCMOS; Frequency Stability: 5ppm; Max Supply Current: 1.52uA; Frequency: 32.768kHz; Max Operating Temperature: 85°C; Ratings: AEC-Q100; Series: SiT1552; Case/Package: SMD/SMT; Min Operating Temperature: -40°C; Mount: Surface Mount; Packaging: Tape and Reel
POWC4 SDC2 STC1 STC2 = CMP-13271-001051-1: Cap Ceramic 1uF 25V X5R ±10% SMD 0402 +85°C Paper T/R; Radiation Hardening: No; Lead Free: Lead Free; Capacitance: 1uF; Package Quantity: 10000; Max Operating Temperature: 85°C; Voltage Rating: 25V; Case/Package: 0402; Min Operating Temperature: -55°C; Packaging: Tape and Reel; Tolerance: 10%; Height: 0.5mm; Thickness: 0.022inch; Case Code (Metric): 1005; Width: 0.02inch; Case Code (Imperial): 0402; Dielectric: X5R; Length: 1mm; Mount: Surface Mount; Material: Ceramic; Depth: 0.5mm
POWER = 502494-0670: Connector; Manufacturer_Name: Molex; Datasheet Link: https://www.molex.com/content/dam/molex/molex-dot-com/products/automated/en-us/salesdrawingpdf/502/502494/5024940670_sd.pdf; Height: 7.1mm; Manufacturer_Part_Number: 502494-0670; Mouser Part Number: 538-502494-0670; Mouser Price/Stock: https://www.mouser.co.uk/ProductDetail/Molex/502494-0670?qs=zRnNmUVysJflJNy8qKc1Eg%3D%3D
SD = 104031-0811: Surface Mount Micro SD Card Connector, with Push In Termination | Molex Incorporated 104031-0811; SnapEDA_Link: https://www.snapeda.com/parts/104031-0811/Molex/view-part/?ref=snap; Package: None; Value: *; MF: Molex; MP: 104031-0811; Check_prices: https://www.snapeda.com/parts/104031-0811/Molex/view-part/?ref=eda
SPI_EXT = CMP-17439-000109-1: CONN HEADER SMD R/A 7POS 1.25MM; Number of Contacts: 7; Wire/Cable Gauge: 26AWG; Voltage Rating (AC): 50V; Pitch: 0.049inch; Current Rating: 1A; Connector Type: Header; Contact Shape: Rectangular; Min Operating Temperature: -25°C; Number of Positions: 7; Contact Material: Bronze; Packaging: Cut Tape; Insulation Material: Nylon; Max Operating Temperature: 85°C; Package Quantity: 2500; Series: GH; Contact Finish - Mating: TIN; Voltage Rating: 50V; Color: Natural; Mount: Surface Mount; Contact Plating: Tin; Termination: Solder; Lead Free: Lead Free; Contact Type: Outer Shroud Contact; Fastening Type: Ramp; Number of Rows: 1; Housing Material: Nylon; Flammability Rating: UL94 V-0; Housing Color: Natural; Insulation Color: Natural
ST = CMP-12105-000050-1: IC MCU 32BIT 2MB FLASH 100LQFP; Manufacturer: STMicroelectronics; Number Of Ethernet Channels: 1; Number Of Usb Channels: 2; Number Of A/D Converters: 3; Min Supply Voltage: 1.71V; Ram Size: 1060KBytes; Number Of I2C Channels: 4; Frequency: 480MHz; Number Of Adc Channels: 36; Number Of I/Os: 82; Max Supply Voltage: 3.6V; Number Of Spi Channels: 6; Memory Size: 2MBytes; Max Junction Temp: +125°C; Core Architecture: Arm Cortex-M7; Interface: I2C,SPI,UART,USART,USB,LIN,IrDA,Ethernet,I2S,Other; Number Of Timers/Counters: 20; Data Bus Width: 32bits; Number Of Pwm Channels: 42; Number Of Uart Channels: 9; Standoff Height: 0.05mm; Device Class L1: Integrated Circuits (ICs); ComponentLink2URL: https://www.st.com/resource/en/datasheet/stm32h743vi.pdf; Automotive: No; Memory Type: FLASH; Number Of Cores: 1; Temperature Range Low: -40°C; RoHS: TRUE; Ambient Temperature Range Low: -40°C; ComponentLink2Description: Datasheet; Device Class L2: Embedded Processors and Controllers; Device Class L3: Microcontrollers; Digikey Description: IC MCU 32BIT 2MB FLASH 100LQFP; Temperature Range High: +125°C; Ambient Temperature Range High: +85°C; Package: LQFP100-1L; Temperature: -40°C to +125°C; Category: IC; Ipc Land Pattern Name: QFP50P1600X1600X160-100; Height: 1.6mm; Manufacturer Part Number: STM32H743VIT6; Octopart: https://octopart.com/stm32h743vit6-stmicroelectronics-76372527; Lead Free: Yes
STC3 STC4 = CMP-13271-000548-1: Cap Ceramic 4.7uF 10V X5R ±20% SMD 0402 +85°C Paper T/R; Capacitance: 4.7uF; Max Operating Temperature: 85°C; Lead Free: Lead Free; Tolerance: 20%; Voltage Rating: 10V; Dielectric: X5R; Width: 0.02inch; Length: 0.039inch; Case/Package: 0402; Min Operating Temperature: -55°C; Packaging: Tape and Reel; Thickness: 0.022inch; Case Code (Imperial): 0402; Package Quantity: 10000; Case Code (Metric): 1005; Mount: Surface Mount
USB = TYPE-C-31-M-12: USB Connectors 24 Receptacle 1 8.94*7.3mm RoHS; MF: HRO Electronics Co., Ltd.; SnapEDA_Link: https://www.snapeda.com/parts/TYPE-C-31-M-12/HRO+Electronics+Co.%252C+Ltd./view-part/?ref=snap; Package: Package; Value: *; MP: TYPE-C-31-M-12; Check_prices: https://www.snapeda.com/parts/TYPE-C-31-M-12/HRO+Electronics+Co.%252C+Ltd./view-part/?ref=eda
USBD1 V5D2 = CMP-08607-000042-1: TVS DIODE 5V 9.2V DO214AA; Manufacturer: Littelfuse Inc; Breakdown Voltage: 6.4V; Direction: Unidirectional; Peak Pulse Current: 65.3A; Max Junction Temp: +150°C; Number Of Channels: 1; Peak Pulse Power: 600W; Clamping Voltage: 9.2V; Octopart: https://octopart.com/smbj5.0a-littelfuse-8835; Package: SMBJ; RoHS: TRUE; Temperature Range Low: -65°C; Device Class L2: TVS Diodes; Automotive: No; ComponentLink2URL: https://www.littelfuse.com/~/media/electronics/datasheets/tvs_diodes/littelfuse_tvs_diode_smbj_datasheet.pdf.pdf; Height: 2.61mm; ComponentLink2Description: Datasheet; Temperature: -65°C to +150°C; Category: Diode; Temperature Range High: +150°C; Lead Free: Yes; Digikey Description: TVS DIODE 5V 9.2V DO214AA; Device Class L1: Circuit Protection; Reverse Standoff Voltage: 5V; Device Class L3: unset; Manufacturer Part Number: SMBJ5.0A; Mouser Description: TVSS; Diode; For Data/Comm; Industrial Equip; 65.3A; SMD; Solder Term; Clamp-V 9.2V
USBR1-USBR3 = 0603WAF5101T5E: Resistor; Manufacturer_Name: UNI-ROYAL(Uniroyal Elec); Datasheet Link: https://datasheet.lcsc.com/szlcsc/Uniroyal-Elec-0603WAF5101T5E_C23186.pdf; Height: 0.55mm; Manufacturer_Part_Number: 0603WAF5101T5E
V5C1in = CMP-1037-04923-3: Chip Multilayer Ceramic Capacitors for General Purpose, 1206, 4.7uF, X7R, 15%, 10%, 50V; Height: 1.6mm; Voltage: 50V; Capacitance: 4.7uF; Lead Free: Lead Free; Max Operating Temperature: 125°C; Packaging: Tape and Reel; REACH SVHC: No SVHC; Voltage Rating: 50V; Mount: Surface Mount; Termination: SMD/SMT; Tolerance: 10%; Case/Package: 1206; Material: Ceramic; Depth: 1.6mm; Length: 3.2mm; Case Code (Metric): 3216; Voltage Rating (DC): 50V; Case Code (Imperial): 1206; Radiation Hardening: No; Width: 0.063inch; Thickness: 0.071inch; Package Quantity: 2000; Min Operating Temperature: -55°C; Dielectric: X7R
V5C2in V5DivC = CMP-2008-04639-2: Chip Multilayer Ceramic Capacitors for General Purpose, 0402, 0.10uF, X7R, 15%, 10%, 50V; Dissipation Factor: 0.025%; Weight: 0.000212oz; Thickness: 0.022inch; Voltage Rating (DC): 50V; Dielectric Material: Ceramic; Termination: SMD/SMT; Case/Package: 0402; Case Code (Imperial): 0402; Mount: Surface Mount; REACH SVHC: No SVHC; Resistor Type: Ceramic; Dielectric: X7R; Max Operating Temperature: 125°C; Voltage: 50V; Lead Free: Lead Free; Package Quantity: 10000; Packaging: Tape and Reel; Capacitance: 100nF; Length: 1mm; Material: Ceramic; Height: 0.5mm; Depth: 0.5mm; Width: 0.5mm; Min Operating Temperature: -55°C; Tolerance: 10%; Case Code (Metric): 1005; Voltage Rating: 50V
V5C4-V5C6 = CMP-2000-06362-2: CAP CER 47UF 16V X5R 1210; Tolerance: 10%; Case Code (Metric): 3225; RoHS Compliant: Yes; Min Operating Temperature: -55°C; Radiation Hardening: No; Voltage: 16V; Package Quantity: 1; Case Code (Imperial): 1210; REACH SVHC: No SVHC; Capacitance: 47uF; Voltage Rating (DC): 16V; Dielectric: X5R; Case/Package: 1210; Length: 3.2mm; Voltage Rating: 16V; Packaging: Cut Tape; Width: 0.098inch; Number of Pins: 2; Lead Free: Lead Free; Height: 2.5mm; Material: Ceramic; Mount: Surface Mount; Termination: SMD/SMT; Max Operating Temperature: 85°C; Thickness: 0.106inch; Depth: 2.5mm
V5Con = CMP-1024-00336-5: Male Header, Pitch 2.54 mm, 2 x 3 Position, Height 8.38 mm, Tail Length 5.08 mm, -55 to 125 degC, RoHS, Bulk; Manufacturer: Samtec; DatasheetVersion: 04/2012; ComponentLink3URL: http://suddendocs.samtec.com/prints/tsw-xxx-xx-x-x-xx-xxx-footprint.pdf; PackageReference: TSW-103-08-L-D; Mounting Technology: Through Hole; Min Operating Temperature: -55 degC; ComponentLink2Description: Datasheet; Lead Pitch: 2.54 mm; ComponentLink1Description: Manufacturer URL; Mount: Through Hole; ComponentLink1URL: http://www.samtec.com/; ComponentLink3Description: Package Specification; Max Operating Temperature: 125 degC; PackageDescription: Male Header, Pitch 2.54 mm, 2 x 3 Position, Height 8.38 mm, Tail Length 5.08 mm; ComponentLink2URL: https://datasheet.ciiva.com/25618/0900766b81154476-25618436.pdf; RoHSCompliant: true
V5D1 = CMP-08607-000022-1: TVS DIODE 36V 58.1V DO214AA; Manufacturer: Littelfuse Inc; Breakdown Voltage: 40V; Number Of Channels: 1; Max Junction Temp: +150°C; Direction: Unidirectional; Peak Pulse Power: 600W; Peak Pulse Current: 10.4A; Device Class L1: Circuit Protection; ComponentLink2Description: Datasheet; Category: Diode; Reverse Standoff Voltage: 36V; Device Class L3: unset; Temperature: -65°C to +150°C; Temperature Range High: +150°C; Height: 2.61mm; Mouser Description: TVS Diodes - Transient Voltage Suppressors 36Vr 600W 10.4A 5% UniDirectional; Temperature Range Low: -65°C; ComponentLink2URL: https://www.littelfuse.com/~/media/electronics/datasheets/tvs_diodes/littelfuse_tvs_diode_smbj_datasheet.pdf.pdf; Octopart: https://octopart.com/smbj36a-littelfuse-37790; Lead Free: Yes; RoHS: TRUE; Manufacturer Part Number: SMBJ36A; Clamping Voltage: 58.1V; Device Class L2: TVS Diodes; Package: SMBJ; Digikey Description: TVS DIODE 36V 58.1V DO214AA; Automotive: No
V5Div1 = RC0603FR-07360KL: Resistor; Manufacturer_Name: KEMET; Datasheet Link: http://www.yageo.com/documents/recent/PYu-RC0603_51_RoHS_L_v5.pdf; Height: 0.55mm; Manufacturer_Part_Number: RC0603FR-07360KL; Mouser Part Number: 603-RC0603FR-07360KL; Mouser Price/Stock: https://www.mouser.co.uk/ProductDetail/Yageo/RC0603FR-07360KL/?qs=diQw95jMAePBWfaBve%2FwbQ%3D%3D
V5Div2 V5R2 = CMP-2002-08508-1: Part Number: CRCW040230K9FKED; Manufacturer: Vishay Dale
V5F1 = 3425L300_36MR: Fuse; Manufacturer_Name: LITTELFUSE; Manufacturer_Part_Number: 3425L300/36MR; Datasheet Link: https://www.arrow.com/en/products/3425l30036mr/littelfuse?region=nac; Height: 1.4mm; Mouser Part Number: 576-3425L300/36MR; Mouser Price/Stock: https://www.mouser.co.uk/ProductDetail/Littelfuse/3425L300-36MR?qs=amGC7iS6iy%252BViy95vVWOuA%3D%3D; Arrow Part Number: 3425L300/36MR; Arrow Price/Stock: https://www.arrow.com/en/products/3425l30036mr/littelfuse?region=nac
V5IC1 = LMR51450FNDRRR: Integrated Circuit; Manufacturer_Name: Texas Instruments; Datasheet Link: https://www.ti.com/lit/ds/symlink/lmr51450.pdf?ts=1681907573404&ref_url=https%253A%252F%252Fwww.ti.com%252Fproduct%252FLMR51450%252Fpart-details%252FLMR51450FNDRRR; Height: 0.8mm; Manufacturer_Part_Number: LMR51450FNDRRR; Mouser Part Number: 595-LMR51450FNDRRR; Mouser Price/Stock: https://www.mouser.co.uk/ProductDetail/Texas-Instruments/LMR51450FNDRRR?qs=rQFj71Wb1eVWWBj0Ni4OAA%3D%3D; Arrow Part Number: LMR51450FNDRRR; Arrow Price/Stock: https://www.arrow.com/en/products/lmr51450fndrrr/texas-instruments?utm_currency=USD&region=nac
V5L1 = CMP-2000-06084-1: Power Inductor, 10 uH, +/- 20%, -40 to 100 degC, 2-Pin SMD, RoHS, Tape and Reel; Manufacturer: Sumida; Catalog Drawings: CDRH127SeriesFrontCDRH127SeriesSideCDRH127SeriesBottom; Product Training Modules: PowerInductorBasics; Current Rating: 5.4A; Shielding: Shielded; Online Catalog: CDRHSeries; DC Resistance (DCR): 21.6mOhmMax; Other Names: 308-1457-1; Inductance: 10µH; Frequency - Test: 1kHz; Mounting Type: SurfaceMount; Datasheet Version: 01/2014; Package Description: 2-Pin Surface Mount Device, Body 12 x 12 mm; Frequency - Self Resonant: -; Package Reference: CDRH127; Category: Inductors,Coils,Chokes; Material - Core: -; Q @ Freq: -; Type: -; Family: FixedInductors; Ratings: -; Series: CDRH127; Manufacturer URL: http://www.sumida.com/; Operating Temperature: -40°C~100°C; Height - Seated (Max): 0.315"(8.00mm); Standard Package: 1; Size / Dimension: 0.472"Lx0.472"W(12.00mmx12.00mm); Current - Saturation: -; Datasheet URL: http://products.sumida.com/products/pdf/CDRH127.pdf; Package / Case: Nonstandard; Tolerance: ±20%; Mounting Technology: SurfaceMount; Packaging: CutTape(CT)
V5Q1 = CMP-02550-000038-1: MOSFET P-CH 100V 28A PPAK SO-8; Manufacturer: Vishay; Number Of P Channels: 1; Drain To Source Voltage: -100V; Reverse Recovery Time: 60ns; Max Junction Temp: +150°C; Threshold Vgs Max: -3V; Depletion Mode: False; Standoff Height: 0mm; Typ Forward Diode Voltage: -0.8V; Rthja Max: 24°C/W; Max Forward Diode Voltage: -1.2V; Transconductance: 38S; Power Dissipation: 5.2W; Continuous Drain Current: -7.8A; Threshold Vgs Min: -1V; Pulse Drain Current: -40A; Turn Off Delay Time: 110ns; Turn On Delay Time: 15ns; Drain To Source Resistance: 0.033Ω; Gate Charge At Vgs: 106nC @ -10V; Reverse Recovery Charge: 150nC; Gate To Source Voltage: 20V; Input Capacitace At Vds: 4600pF @ -50V; Category: Trans; Manufacturer Part Number: SI7489DP-T1-E3; Temperature: -55°C to +150°C; ComponentLink2Description: Datasheet; Number Of Channels: 1; Lead Free: Yes; Temperature Range High: +150°C; Device Class L3: MOSFETs; Mouser Description: MOSFET 100V 28A 83W; Drain To Source Breakdown Voltage: -100V; Device Class L1: Discrete Semiconductors; Height: 1.17mm; Temperature Range Low: -55°C; ComponentLink2URL: http://www.vishay.com/docs/73436/si7489dp.pdf; Device Class L2: Transistors; Digikey Description: MOSFET P-CH 100V 28A PPAK SO-8; Octopart: https://octopart.com/si7489dp-t1-e3-vishay-42302267; Package: S17-0173-SINGLE; RoHS: TRUE; Automotive: No
V5R0 V31R0 V32R0 = AC2512JK-070RL: Resistor; Manufacturer_Name: YAGEO; Datasheet Link: https://www.yageo.com/upload/media/product/productsearch/datasheet/rchip/PYu-AC_51_RoHS_L_11.pdf; Height: 0.65mm; Manufacturer_Part_Number: AC2512JK-070RL
V5R1 V5R3 V5R4 V31R1 V32R1 = 0805W8F1003T5E: Resistor; Manufacturer_Name: ROYALOHM; Datasheet Link: https://www.mouser.in/datasheet/2/1365/1-3044649.pdf; Height: 0.65mm; Manufacturer_Part_Number: 0805W8F1003T5E; Mouser Part Number: 303-0805W8F1003T5E; Mouser Price/Stock: https://www.mouser.co.uk/ProductDetail/Royalohm/0805W8F1003T5E?qs=e8oIoAS2J1ShnA7x9P0k6g%3D%3D
V5R5 = CMP-2002-08240-2: RES Thick Film, 16.9kΩ, 1%, 0.063W, 100ppm/°C, 0402; Resistance: 16.9kR; Voltage Rating: 50V; Max Power Dissipation: 63mW; Tolerance: 1%; Weight: 2.3E-05oz; Case/Package: 0402; Package Quantity: 10; Packaging: Tape and Reel; Case Code (Imperial): 0402; Number of Pins: 2; Height: 0.016inch; Width: 0.02inch; Number of Terminations: 2; Depth: 0.5mm; Composition: Thick Film; Features: Automotive AEC-Q200; Termination: SMD/SMT; Radiation Hardening: No; Temperature Coefficient: 100ppm/°C; Military Standard: Not; Length: 1mm; Min Operating Temperature: -55°C; Contact Plating: Tin; Max Operating Temperature: 155°C; Power Rating: 63mW; Case Code (Metric): 1005
V5S1 = SS34C: Schottky Diode; Manufacturer_Name: MDD; Datasheet Link: https://4donline.ihs.com/images/VipMasterIC/IC/DCNG/DCNGS00334/DCNGS00429-1.pdf?hkey=EF798316E3902B6ED9A73243A3159BB0; Height: 2.62mm; Manufacturer_Part_Number: SS34C
V5Z1 = BZT52C15-E3-08: Zener Diode; Manufacturer_Name: Vishay; Datasheet Link: https://www.vishay.com/docs/85760/bzt52.pdf; Height: 1.35mm; Manufacturer_Part_Number: BZT52C15-E3-08; Mouser Part Number: 78-BZT52C15-E3-08; Mouser Price/Stock: https://www.mouser.co.uk/ProductDetail/Vishay-Semiconductors/BZT52C15-E3-08?qs=KP8Io%2FXyE5T2xU7%252Bcte76g%3D%3D; Arrow Part Number: BZT52C15-E3-08; Arrow Price/Stock: https://www.arrow.com/en/products/bzt52c15-e3-08/vishay?utm_currency=USD&region=nac
V31C1 V32C1 = CMP-2007-03243-2: CAP CER 10UF 10V X5R 0805; Manufacturer Part Number: C0805C106K8PACTU; Manufacturer: Kemet; 3DS Part Number: 220-00001; Tolerance: 10%; Temperature Coefficient: 15%; Device Class L2: Capacitors; Device Class L1: Passive Components; ComponentLink2URL: https://content.kemet.com/datasheets/KEM_C1006_X5R_SMD.pdf; Height: 1.4mm; Lead Free: Yes; Digikey Description: CAP CER 10UF 10V X5R 0805; Octopart: https://octopart.com/c0805c106k8pactu-kemet-98697; Capacitance: 10uF; Value: 10uF; Temperature Range Low: -55°C; Temperature: -55°C to +85°C; Automotive: No; Mouser Description: CAP CER 10UF 10V X5R 0805; Ipc Land Pattern Name: CAPC200125X125; Material: Ceramic; Temperature Range High: +85°C; Voltage: 10V; RoHS: TRUE; Device Class L3: Ceramic Capacitors; ComponentLink2Description: Datasheet; Voltage Rating: 10V; Package: C0805C-DG; Temperature Characteristic: X5R; Category: Cap
V31C2 V32C2 = CMP-03422-000674-1: CAP CER 390PF 50V X7R 0603; Manufacturer: YAGEO; Manufacturer Part Number: CC0603KRX7R9BB391; Tolerance: 0.1; Temperature Coefficient: 15%; Device Class L1: Passive Components; Height: 0.9mm; RoHS: TRUE; Octopart: https://octopart.com/cc0603krx7r9bb391-yageo-39467837; Device Class L3: Ceramic Capacitors; ComponentLink2Description: Datasheet; Category: Cap; Digikey Description: CAP CER 390PF 50V X7R 0603; Device Class L2: Capacitors; Voltage: 50 V; Temperature Range Low: -55°C; Temperature: -55°C to +125°C; Temperature Range High: +125°C; Temperature Characteristic: X7R; ComponentLink2URL: http://www.yageo.com/documents/recent/UPY-GPHC_X7R_6.3V-to-50V_18.pdf; Material: Ceramic; Package: CC0603-DA; Mouser Description: 0603 390 pF 50 V ±10 % Tolerance X7R SMT Multilayer Ceramic Capacitor; Lead Free: Yes; Footprint Url: http://www.yageo.com/exep/pages/download/literatures/UPY-C_GEN_24.pdf; Automotive: No; Value: 390 pF; Voltage Rating: 50 V; Capacitance: 390 pF
V31C3 V32C3 = GRM188R60J226MEA0D: Capacitor; Manufacturer_Name: Murata Electronics; Datasheet Link: https://search.murata.co.jp/Ceramy/image/img/A01X/G101/ENG/GRM188R60J226MEA0-01A.pdf; Height: 0.9mm; Manufacturer_Part_Number: GRM188R60J226MEA0D; Mouser Part Number: 81-GRM188R60J226ME0D; Mouser Price/Stock: https://www.mouser.co.uk/ProductDetail/Murata-Electronics/GRM188R60J226MEA0D?qs=p%2FZgMVRdWRkAKoLX3oNjgw%3D%3D; Arrow Part Number: GRM188R60J226MEA0D; Arrow Price/Stock: https://www.arrow.com/en/products/grm188r60j226mea0d/murata-manufacturing?utm_currency=USD&region=nac
V31L1 V32L1 = PA4332.222NLT: Inductor; Manufacturer_Name: PULSE; Datasheet Link: https://datasheet.datasheetarchive.com/originals/distributors/DKDS-10/182650.pdf; Height: 2mm; Manufacturer_Part_Number: PA4332.222NLT; Mouser Part Number: 673-PA4332222NLT; Mouser Price/Stock: https://www.mouser.co.uk/ProductDetail/Pulse-Electronics/PA4332.222NLT?qs=%2FzQKu7YvIMbE5ttuY4d%2Fzg%3D%3D; Arrow Part Number: PA4332.222NLT; Arrow Price/Stock: https://www.arrow.com/en/products/pa4332.222nlt/pulse-electronics-corporation?utm_currency=USD&region=nac
V31U1 V32U1 = CMP-0323-00127-3: Buck Step Down Regulator with 3 to 17 V Input and 3.3 V Output, -40 to 85 degC, 16-Pin QFN (RGT), Green (RoHS & no Sb/Br); Manufacturer: Texas Instruments; Vin(Min)(V): 3; Synchronous Rectification: TRUE; Vin(Max)(V): 17; Iout(Max)(A): 2; Regulated Outputs(#): 1; Vout(Min)(V): 3.3; Iq(Typ)(mA): 0.017; Rating: Catalog; SubFamily: Step-Down Regulator; Duty Cycle(Max)(%): 100; Code_JEDEC: MO-220; ComponentLink1Description: Datasheet; PackageReference: RGT0016C; PackageDescription: 16-Pin Plastic Quad Flat No-Lead, 3 x 3 mm Body, 0.5 mm Pitch, 1.7 x 1.7 mm Exposed Pad; ComponentLink2URL: http://www.ti.com/litv/pdf/mpqf119g; PartNumber: TPS62142RGTT; ComponentLink1URL: http://www.ti.com/general/docs/lit/getliterature.tsp?genericPartNumber=TPS62142&fileType=pdf; Switch Current Limit(Typ)(A): 3; ComponentLink3Description: URL Link1; Eco-Plan: Green (RoHS & no Sb/Br); Mounting Technology: Surface Mount; PackageVersion: revH, Oct-2011; ComponentLink3URL: Samples URL:http://www.ti.com/product/tps54611#samples; Preset Vout(V): 3.3; Vout(Max)(V): 3.3; ComponentLink2Description: Package Specification; Topology: Buck; DatasheetVersion: SLVSAJ0